# Altium schematic sheet LightADC.SchDoc
size A4
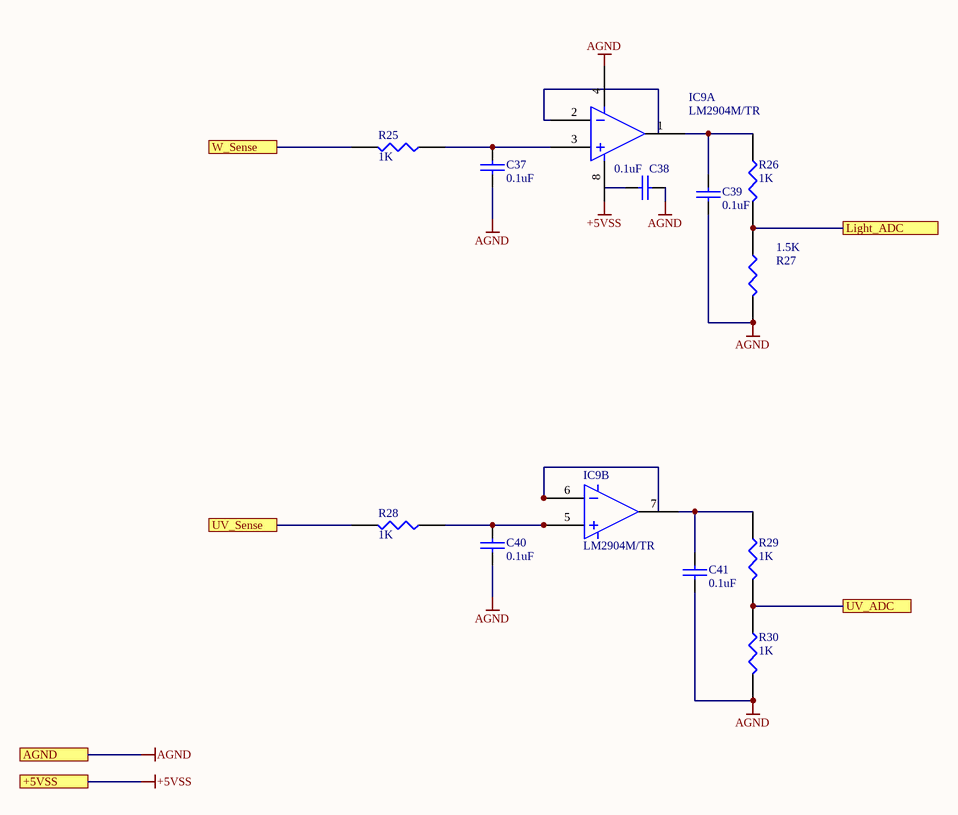
[diagram p0: LightADC.SchDoc]

## Parts
C37  0.1uF  [0805C]
C38  0.1uF  [0603C]
C39  0.1uF  [0603C]
C40  0.1uF  [0805C]
C41  0.1uF  [0805C]
IC9  LM2904M/TR  [LM2904M/TR]  (parts A,B of 2)
R25  1K  [0805R]
R26  1K  [0805R]
R27  1.5K  [0805R]
R28  1K  [0805R]
R29  1K  [0805R]
R30  1K  [0805R]

## Ports
+5VSS, AGND, Light_ADC, UV_ADC, UV_Sense, W_Sense

## Nets
+5VSS: IC9.8 ; port +5VSS
AGND: C37.2 C38.1 C39.2 C40.2 C41.2 R27.2 R30.2 ; port AGND
Light_ADC: R26.2 R27.1 ; port Light_ADC
UV_ADC: R29.2 R30.1 ; port UV_ADC
UV_Sense: R28.2 ; port UV_Sense
W_Sense: R25.2 ; port W_Sense
NetC37_1: C37.1 IC9.3 R25.1
NetC39_1: C39.1 IC9.1 R26.1
NetC40_1: C40.1 IC9.5 R28.1
NetC41_1: C41.1 IC9.7 R29.1

Not connected (* = marked no-connect by the designer): C38 2; IC9 2 4 6

## Library data of the parts
C37-C41 = CAP: Capacitor
IC9 = TL072
R25-R30 = RES1